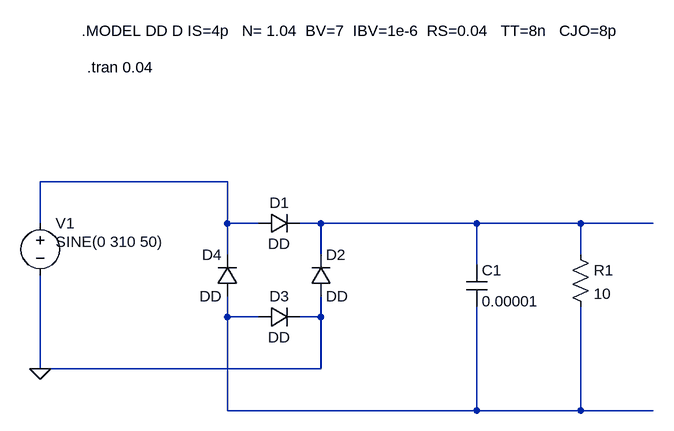
[diagram p0: schematic Draft3.asc]
Draft3.asc, the LTspice schematic file:
Version 4
SHEET 1 904 680
WIRE 224 208 -64 208
WIRE -64 272 -64 208
WIRE 224 272 224 208
WIRE 272 272 224 272
WIRE 368 272 336 272
WIRE 608 272 368 272
WIRE 768 272 608 272
WIRE 880 272 768 272
WIRE 224 320 224 272
WIRE 368 320 368 272
WIRE 768 320 768 272
WIRE 608 336 608 272
WIRE 224 416 224 384
WIRE 272 416 224 416
WIRE 368 416 368 384
WIRE 368 416 336 416
WIRE -64 496 -64 352
WIRE 368 496 368 416
WIRE 368 496 -64 496
WIRE 224 560 224 416
WIRE 608 560 608 400
WIRE 608 560 224 560
WIRE 768 560 768 400
WIRE 768 560 608 560
WIRE 880 560 768 560
FLAG -64 496 0
SYMBOL voltage -64 256 R0
WINDOW 3 24 44 Left 2
WINDOW 123 0 0 Left 0
WINDOW 39 0 0 Left 0
SYMATTR Value SINE(0 310 50)
SYMATTR InstName V1
SYMBOL diode 272 288 R270
WINDOW 0 32 32 VTop 2
WINDOW 3 0 32 VBottom 2
SYMATTR InstName D1
SYMATTR Value DD
SYMBOL diode 352 384 M180
WINDOW 0 24 64 Left 2
WINDOW 3 24 0 Left 2
SYMATTR InstName D2
SYMATTR Value DD
SYMBOL diode 272 432 R270
WINDOW 0 32 32 VTop 2
WINDOW 3 0 32 VBottom 2
SYMATTR InstName D3
SYMATTR Value DD
SYMBOL diode 240 384 R180
WINDOW 0 24 64 Left 2
WINDOW 3 24 0 Left 2
SYMATTR InstName D4
SYMATTR Value DD
SYMBOL cap 592 336 R0
SYMATTR InstName C1
SYMATTR Value 0.00001
SYMBOL res 752 304 R0
SYMATTR InstName R1
SYMATTR Value 10
TEXT 0 -24 Left 2 !.MODEL DD D IS=4p   N= 1.04  BV=7  IBV=1e-6  RS=0.04   TT=8n   CJO=8p
TEXT 8 32 Left 2 !.tran 0.04

The netlist it stands for:
* Draft3.asc
V1 N001 0 SINE(0 310 50)
D1 N001 N002 DD
D2 0 N002 DD
D3 N003 0 DD
D4 N003 N001 DD
C1 N002 N003 0.00001
R1 N002 N003 10
.model D D
.lib standard.dio
.MODEL DD D IS=4p   N= 1.04  BV=7  IBV=1e-6  RS=0.04   TT=8n   CJO=8p
.tran 0.04
.backanno
.end